# Altium schematic sheet [03] ESP32.SchDoc: ESP32
size A4; Organization: Blinkinlabs, LLC; DocumentNumber: 3; SheetNumber: 3; SheetTotal: 7
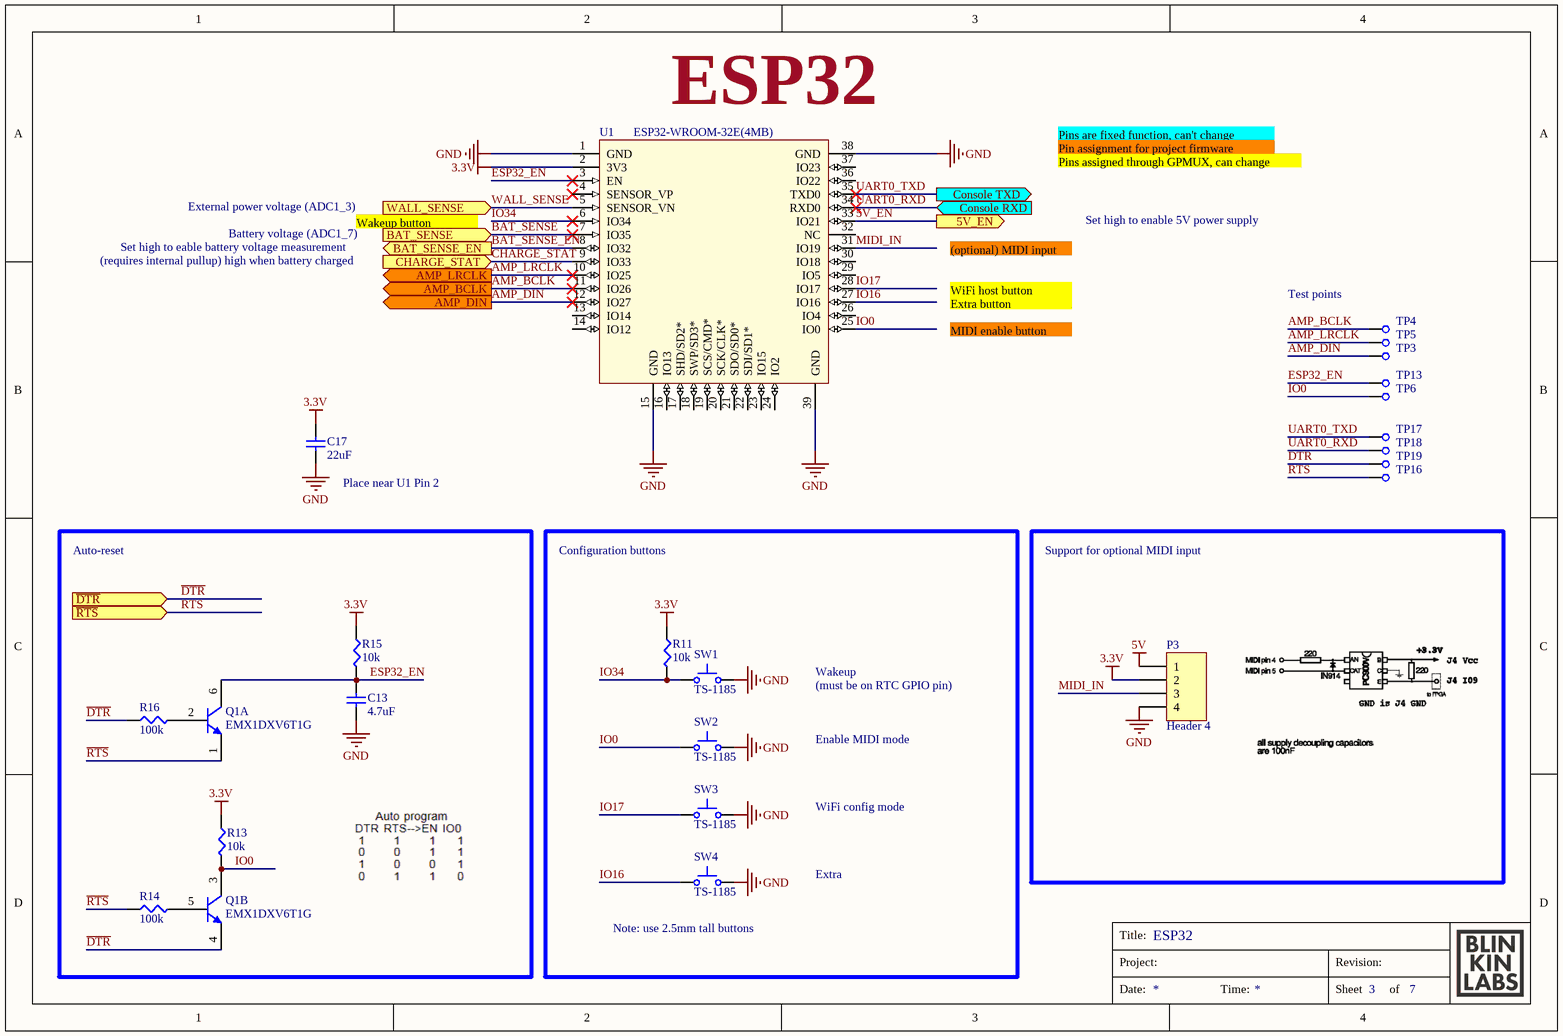
[diagram p0: [03] ESP32.SchDoc]

## Parts
C13  4.7uF  [CAPC1608X09L]
C17  22uF  [CAPC1608X09L]
P3  Header 4  [HDR1X4]
Q1  EMX1DXV6T1G  [ONSC-SOT-563-6-463A-01_V]  (parts A,B of 2)
R11  10k  [ERJ2G(0402)_L]
R13  10k  [ERJ2G(0402)_L]
R14  100k  [ERJ2G(0402)_L]
R15  10k  [ERJ2G(0402)_L]
R16  100k  [ERJ2G(0402)_L]
SW1  TS-1185  [TS-1185]
SW2  TS-1185  [TS-1185]
SW3  TS-1185  [TS-1185]
SW4  TS-1185  [TS-1185]
TP3  TEST_POINT  [TP-SMD-1mm]  (value not drawn)  (no BOM)
TP4  TEST_POINT  [TP-SMD-1mm]  (value not drawn)  (no BOM)
TP5  TEST_POINT  [TP-SMD-1mm]  (value not drawn)  (no BOM)
TP6  TEST_POINT  [TP-SMD-1mm]  (value not drawn)  (no BOM)
TP13  TEST_POINT  [TP-SMD-1mm]  (value not drawn)  (no BOM)
TP16  TEST_POINT  [TP-SMD-1mm]  (value not drawn)  (no BOM)
TP17  TEST_POINT  [TP-SMD-1mm]  (value not drawn)  (no BOM)
TP18  TEST_POINT  [TP-SMD-1mm]  (value not drawn)  (no BOM)
TP19  TEST_POINT  [TP-SMD-1mm]  (value not drawn)  (no BOM)
U1  ESP32-WROOM-32E(4MB)  [ESP32-WROOM-32-shortpad]

## Blocks framed on the sheet
Auto-reset: C13 Q1 R13-R16
Support for optional MIDI input: P3

## Ports
5V_EN (out), AMP_BCLK (out), AMP_DIN (out), AMP_LRCLK (out), BAT_SENSE (in), BAT_SENSE_EN (out), CHARGE_STAT (in), Console RXD (in), Console TXD (out), WALL_SENSE (in), ~{DTR} (in), ~{RTS} (in)

## Nets
3.3V: C17.1 P3.2 R11.1 R13.1 R15.1 U1.2(3V3)
5V: P3.1
GND: C13.2 C17.2 P3.4 SW1.2 SW2.2 SW3.2 SW4.2 U1.1(GND) U1.15(GND) U1.38(GND) U1.39(GND)
5V_EN: U1.33(IO21) ; port 5V_EN
AMP_BCLK: TP4.1(TP) U1.11(IO26) ; port AMP_BCLK
AMP_DIN: TP3.1(TP) U1.12(IO27) ; port AMP_DIN
AMP_LRCLK: TP5.1(TP) U1.10(IO25) ; port AMP_LRCLK
BAT_SENSE: U1.7(IO35) ; port BAT_SENSE
BAT_SENSE_EN: U1.8(IO32) ; port BAT_SENSE_EN
CHARGE_STAT: U1.9(IO33) ; port CHARGE_STAT
~{DTR}: Q1.4(E) R16.1 TP19.1(TP) ; port ~{DTR}
ESP32_EN: C13.1 Q1.6(C) R15.2 TP13.1(TP) U1.3(EN)
IO0: Q1.3(C) R13.2 SW2.1 TP6.1(TP) U1.25(IO0)
IO16: SW4.1 U1.27(IO16)
IO17: SW3.1 U1.28(IO17)
IO34: R11.2 SW1.1 U1.6(IO34)
MIDI_IN: P3.3 U1.31(IO19)
~{RTS}: Q1.1(E) R14.1 TP16.1(TP) ; port ~{RTS}
UART0_RXD: TP18.1(TP) U1.34(RXD0) ; port Console RXD
UART0_TXD: TP17.1(TP) U1.35(TXD0) ; port Console TXD
WALL_SENSE: U1.5(SENSOR_VN) ; port WALL_SENSE
NetQ1_2: Q1.2(B) R16.2
NetQ1_5: Q1.5(B) R14.2

Not connected (* = marked no-connect by the designer): U1 4(SENSOR_VP)* 13(IO14) 14(IO12) 16(IO13) 17(SHD/SD2*) 18(SWP/SD3*) 19(SCS/CMD*) 20(SCK/CLK*) 21(SDO/SD0*) 22(SDI/SD1*) 23(IO15) 24(IO2) 26(IO4) 29(IO5) 30(IO18) 32(NC) 36(IO22) 37(IO23)

## Notes on the sheet
- Pins are fixed function, can't change
- Pins assigned through GPMUX, can change
- Pin assignment for project firmware
- Set high to eable battery voltage measurement
- External power voltage (ADC1_3)
- Battery voltage (ADC1_7)
- Wakeup button
- (optional) MIDI input
- Set high to enable 5V power supply
- (requires internal pullup) high when battery charged
- Extra button
- WiFi host button
- Test points
- MIDI enable button
- (near C17) Place near U1 Pin 2
- Configuration buttons
- Wakeup
- (must be on RTC GPIO pin)
- Enable MIDI mode
- WiFi config mode
- Extra
- (near SW4) Note: use 2.5mm tall buttons
- Title:
- Project:
- Revision:
- Date:
- Time:
- Sheet
- of

## Library data of the parts
C13 = GRM185R61A475KE11D: CAP CER 4.7UF 10V X5R 0603; Manufacturer: Murata Electronics North America; Tolerance: ±10%; PartNumber: GRM185R61A475KE11D; Datasheets: http://www.murata.com/~/media/webrenewal/support/library/catalog/products/capacitor/mlcc/c02e.pdf; Image: //media.digikey.com/Renders/Murata%20Renders/ZRB-SERIES-0402.jpg; Digi-Key Part Number: 490-11988-1-ND; Series: GRM; Value: 4.7uF; Voltage: 10V; Temperature Coefficient: X5R; Operating Temperature: -55°C ~ 85°C; Features: -; Applications: General Purpose; Package / Case: 0603 (1608 Metric); Case/Package: 0603
C17 = GRM187R61A226ME15D: CAP CER 22UF 10V X5R 0603; Manufacturer: Murata Electronics North America; Tolerance: ±20%; PartNumber: GRM187R61A226ME15D; Datasheets: http://psearch.en.murata.com/capacitor/product/GRM187R61A226ME15%23.pdf; Image: //media.digikey.com/Renders/Murata%20Renders/ZRB-SERIES-0402.jpg; Digi-Key Part Number: 490-13243-1-ND; Series: GRM; Value: 22uF; Voltage: 10V; Temperature Coefficient: X5R; Operating Temperature: -55°C ~ 85°C; Features: Derating Recommended; Applications: General Purpose; Package / Case: 0603 (1608 Metric); Case/Package: 0603
P3 = Header 4: Header, 4-Pin; LatestRevisionDate: 17-Jul-2002; LatestRevisionNote: Re-released for DXP Platform.; Publisher: Altium Limited
Q1 = CMP-1048-00890-1: Dual NPN General Purpose Amplifier Transistors, 6-Pin SOT-563, Pb-Free, Tape and Reel; Manufacturer: On Semiconductor; IC Continuous (A): 0.1; ComponentLink3URL: http://www.onsemi.cn/pub_link/Collateral/463A-01.PDF; ComponentLink2URL: http://www.onsemi.com/pub_link/Collateral/EMX1DXV6T1-D.PDF; PackageDescription: 6-Pin Small Outline Transistor, Body 1.6 x 1.2 mm, Pitch 0.5 mm; ComponentLink1URL: http://www.onsemi.com/; ComponentLink1Description: Manufacturer URL; PartNumber: EMX1DXV6T1G; DatasheetVersion: Rev. 1; Polarity: Dual NPN; PackageReference: SOT-563-6-463A-01; RoHS: TRUE; ComponentLink2Description: Datasheet; Packing: Tape and Reel; Mounting Technology: Surface Mount; ComponentLink3Description: Package Specification; PackageVersion: Rev. F, 04/2005
R11 R13 R15 = ERJ-2GEJ103X: RES SMD 10K OHM 5% 1/10W 0402; Manufacturer: Panasonic Electronic Components; Power (Watts): 0.1W, 1/10W; Temperature Coefficient: ±200ppm/°C; PartNumber: ERJ-2GEJ103X; Datasheets: http://industrial.panasonic.com/www-cgi/jvcr13pz.cgi?E+PZ+3+AOA0001+ERJ2GEJ103X+7+WW; Image: //media.digikey.com/Photos/Panasonic%20Photos/ERJ-PA2-Series.jpg; Digi-Key Part Number: P10KJCT-ND; Series: ERJ; Value: 10k; Tolerance: ±5%; Composition: Thick Film; Features: Automotive AEC-Q200; Operating Temperature: -55°C ~ 155°C; Package / Case: 0402 (1005 Metric); Case/Package: 0402; Size / Dimension: 0.039" L x 0.020" W (1.00mm x 0.50mm); Height - Seated (Max): 0.016" (0.40mm); Number of Terminations: 2
R14 R16 = ERJ-2GEJ104X: RES SMD 100K OHM 5% 1/10W 0402; Manufacturer: Panasonic Electronic Components; Power (Watts): 0.1W, 1/10W; Temperature Coefficient: ±200ppm/°C; PartNumber: ERJ-2GEJ104X; Datasheets: http://industrial.panasonic.com/www-cgi/jvcr13pz.cgi?E+PZ+3+AOA0001+ERJ2GEJ104X+7+WW; Image: //media.digikey.com/Photos/Panasonic%20Photos/ERJ-PA2-Series.jpg; Digi-Key Part Number: P100KJCT-ND; Series: ERJ; Value: 100k; Tolerance: ±5%; Composition: Thick Film; Features: Automotive AEC-Q200; Operating Temperature: -55°C ~ 155°C; Package / Case: 0402 (1005 Metric); Case/Package: 0402; Size / Dimension: 0.039" L x 0.020" W (1.00mm x 0.50mm); Height - Seated (Max): 0.016" (0.40mm); Number of Terminations: 2
SW1-SW4 = TS-1185: Tact Switch, 3x4mm, no alignment pin, turtle style; Manufacturer: XKB; PartNumber: TS-1185
TP3-TP6 TP13 TP16-TP19 = TEST_POINT: Test point
U1 = ESP32-WROOM-32E(4MB): 32-bit MCU & 2.4 GHz Wi-Fi & Bluetooth/Bluetooth LE; Manufacturer: Espressif Systems; PartNumber: ESP32-WROOM-32E(4MB); LCSC PartNumber: C701341; Parameter 2: *